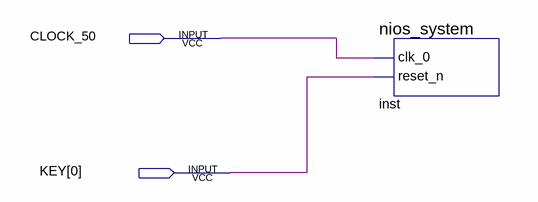
[diagram p0: schematic sheet]
// Quartus schematic lab3.bdf as structural Verilog: 1 symbols, 2 pins
module lab3 (
  input  CLOCK_50,
  input  [0:0] KEY
);

  nios_system inst (.clk_0(CLOCK_50), .reset_n(KEY[0]));
endmodule
